# EAGLE design object counter (EAGLE 6.5.0)
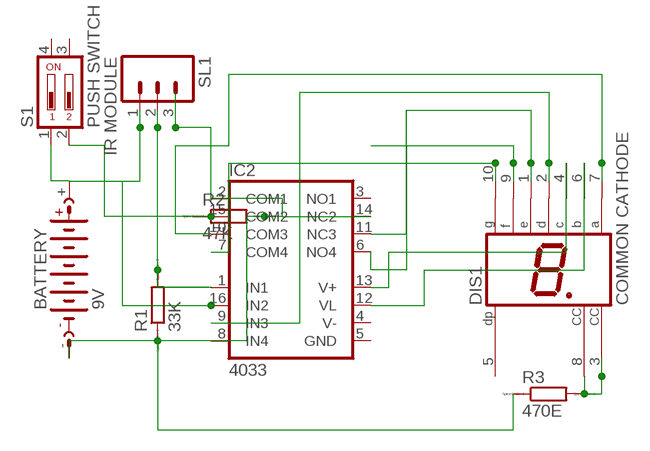
[diagram p0: schematic, sheet 1]

## Parts
BATTERY  9V  AB9V  [AB9V]
DIS1  COMMON CATHODE  HD-H103  [HDSP-M]
IC2  4033  MAX314EPE  [DIL16]
R1  33K  R0204/7  [0204/7]
R2  47K  R0204/7  [0204/7]
R3  470E  R0204/7  [0204/7]
S1  PUSH SWITCH  DS02  [DS-02]
SL1  IR MODULE  M03  [03P]

## Nets
N$1: BATTERY.- IC2.2(COM1) IC2.8(IN4) IC2.14(NC2) R1.1 R2.2 R3.1 SL1.3
N$2: BATTERY.+ IC2.16(IN2) S1.1 SL1.1
N$3: DIS1.3(CC) DIS1.8(CC) R3.2
N$4: IC2.1(IN1) R1.2 SL1.2
N$5: DIS1.7(A) IC2.10(COM3)
N$6: DIS1.6(B) IC2.12(VL)
N$7: DIS1.4(C) IC2.13(V+)
N$8: DIS1.2(D) IC2.9(IN3)
N$9: DIS1.1(E) IC2.11(NC3)
N$10: DIS1.9(F) IC2.6(NO4)
N$11: DIS1.10(G) IC2.7(COM4)
N$12: IC2.15(COM2) R2.1 S1.2
Unconnected: DIS1.5(DP) IC2.3(NO1) S1.3 S1.4

## Power pins joined to a net without a drawn wire
GND: IC2.5(GND)
V-: IC2.4(V-)

## Library data of the parts
BATTERY = battery:AB9V: 9-V BATTERY CLIP
DIS1 = display-hp:HD-H103: LED DISPLAY 1-character 7 segment, decimal point right; OC_FARNELL: unknown; OC_NEWARK: unknown
IC2 = maxim:MAX314: 10?, Quad, SPST, CMOS Analog Switches Source: http://datasheets.maxim-ic.com/en/ds/MAX312-MAX314.pdf; MPN: MAX314EPE+; OC_FARNELL: unknown; OC_NEWARK: 99K3225
R1-R3 = eagle-ltspice:R: RESISTOR, European symbol; SPICEMODEL: NONE; SPICEPREFIX: R
S1 = switch-dil:DS02: DIL/CODE SWITCH; OC_FARNELL: 9472126; OC_NEWARK: unknown
SL1 = con-amp-quick:M03: AMP QUICK CONNECTOR; OC_FARNELL: unknown; OC_NEWARK: unknown

## Board
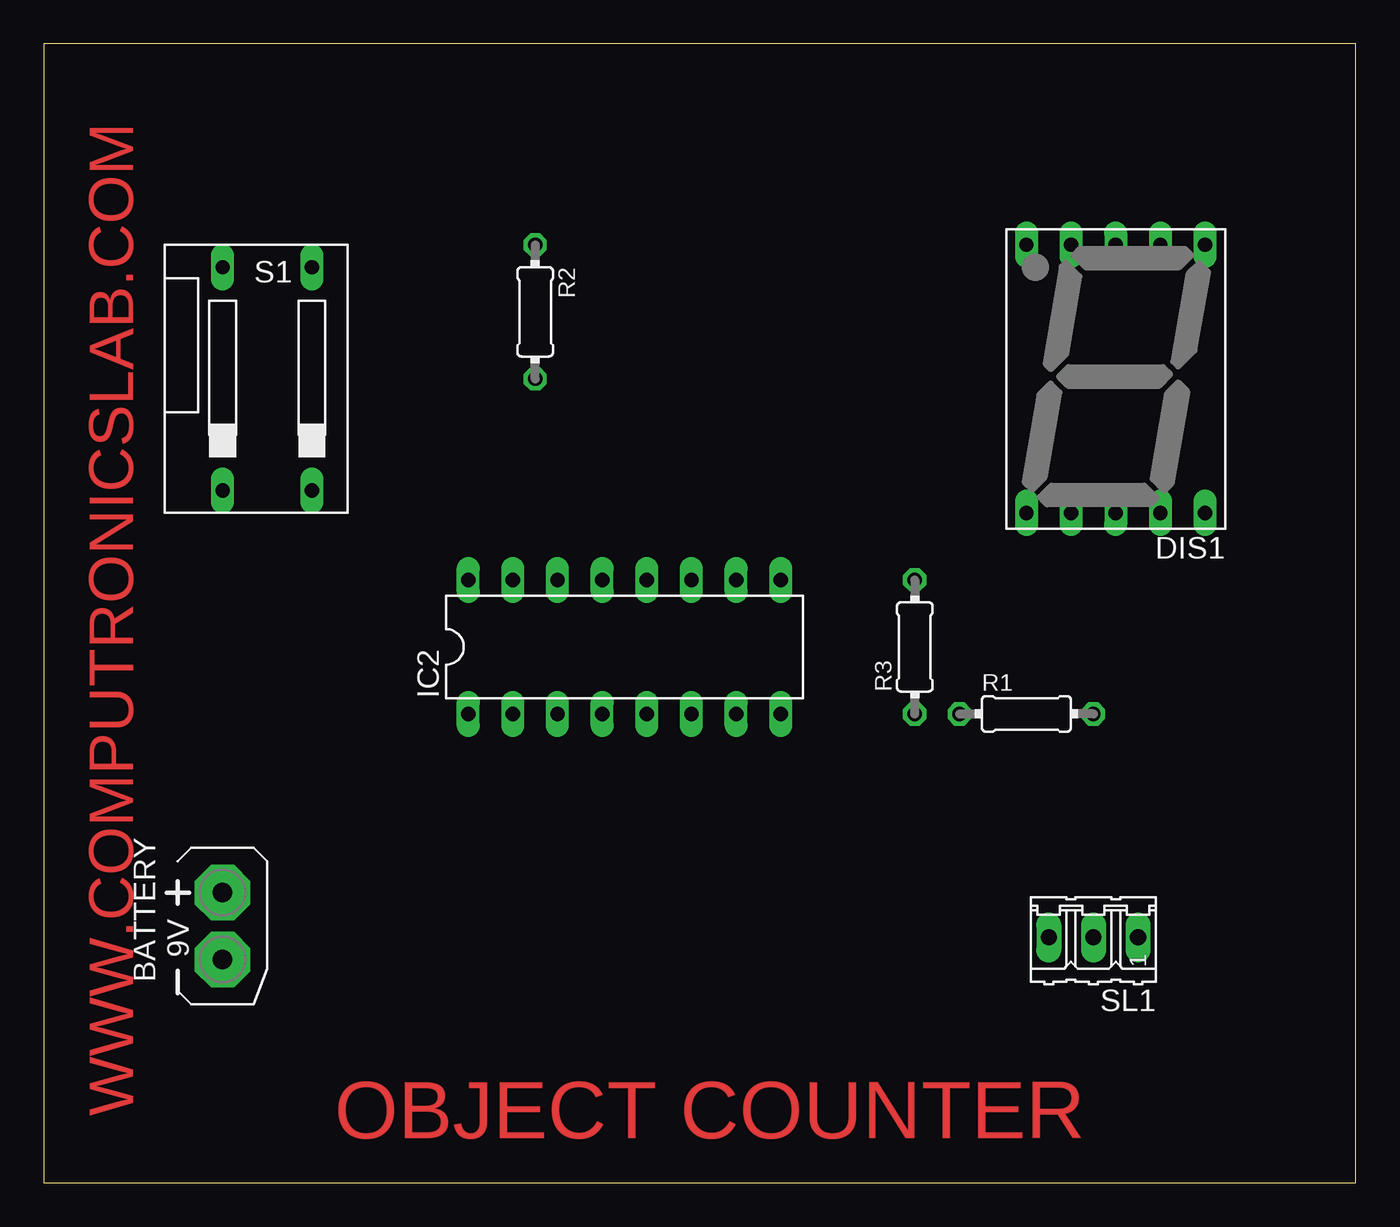
[diagram p1: board, top side]
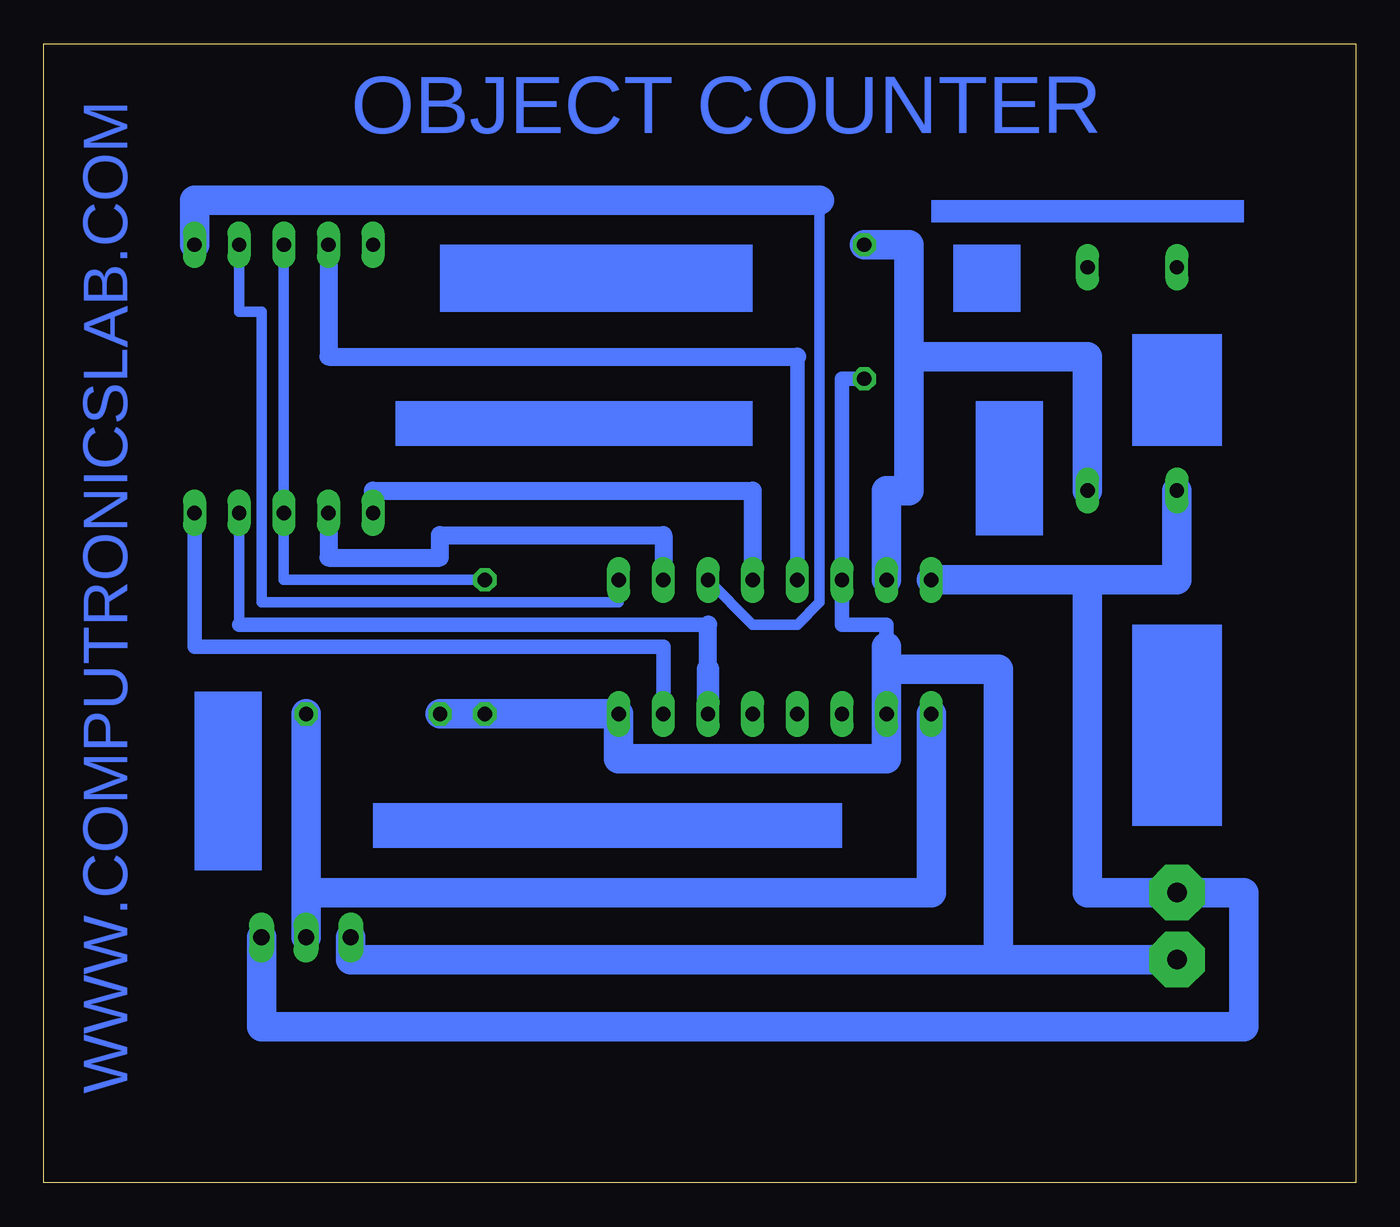
[diagram p2: board, bottom side, seen from below]

Size 74.6 x 64.76 mm. Coordinates in mm from the lower left corner, seen from the top.
Outline: 0,0 74.6,0 74.6,64.76 0,64.76 0,0
Copper layers (1*16): Top 0.035mm / dielectric 1.5mm / Bottom 0.035mm
Design rules "default": minimum track width 10mil, minimum drill 24mil, track to track 8mil, track to pad 8mil, pad to pad 8mil, via to via 8mil, smd to smd 8mil, copper to edge 40mil, drill to drill 8mil, minimum pad ring 10mil, minimum via ring 8mil, stop-mask expansion 4mil, vias tented up to drill 0mil, thermal gap 10mil

### Footprints (pad centres in the part's own frame; a part is rotated, then mirrored left to right if it is on the bottom)
AB9V = drill 1.118 pad 3.15 octagon: + 0,2.54; - 0,-1.27
HDSP-M = drill 0.813 long: 1 -5.08,-7.62; 2 -2.54,-7.62; 3 0,-7.62; 4 2.54,-7.62; 5 5.08,-7.62; 6 5.08,7.62; 7 2.54,7.62; 8 0,7.62; 9 -2.54,7.62; 10 -5.08,7.62
DIL16 = drill 0.813 long: 1 -8.89,-3.81; 2 -6.35,-3.81; 3 -3.81,-3.81; 4 -1.27,-3.81; 5 1.27,-3.81; 6 3.81,-3.81; 7 6.35,-3.81; 8 8.89,-3.81; 9 8.89,3.81; 10 6.35,3.81; 11 3.81,3.81; 12 1.27,3.81; 13 -1.27,3.81; 14 -3.81,3.81; 15 -6.35,3.81; 16 -8.89,3.81
0204/7 = drill 0.813 octagon: 1 -3.81,0; 2 3.81,0
DS-02 = drill 0.813 long: 1 -5.08,-6.35; 2 0,-6.35; 3 0,6.35; 4 -5.08,6.35
03P = drill 0.914 long: 1 -2.54,0; 2 0,0; 3 2.54,0

### Placement (x,y rotation side)
BATTERY  10.16,13.97 0 top
DIS1  60.96,45.72 180 top
IC2  33.02,30.48 0 top
R1  55.88,26.67 0 top
R2  27.94,49.53 270 top
R3  49.53,30.48 90 top
S1  15.24,45.72 0 top
SL1  59.69,13.97 180 top

### Tracks (layer width: path | path; a pad name or v marks a point on that pad's centre or on a via)
N$1
  Bottom 0.813: IC2.2 26.67,31.75 29.21,31.75 IC2.14 29.21,45.72 R2.2
  Bottom 1.676: R1.1 R3.1 IC2.8 41.91,24.13 26.67,24.13 IC2.2 26.67,29.21 | SL1.3 57.15,12.7 20.32,12.7 | BATTERY.- 20.32,12.7 | 26.67,29.21 26.67,30.48 | 26.67,29.21 20.32,29.21 20.32,12.7
N$2
  Bottom 1.676: 15.24,34.29 10.16,34.29 S1.1 | IC2.16 15.24,34.29 | SL1.1 62.23,8.89 6.35,8.89 6.35,16.51 BATTERY.+ 15.24,16.51 15.24,34.29
N$3
  Bottom 0.61: R3.2 60.96,34.29 DIS1.8 DIS1.3
N$4
  Bottom 1.676: IC2.1 24.13,16.51 59.69,16.51 | SL1.2 59.69,16.51 | 59.69,16.51 R1.2
N$5
  Bottom 1.016: IC2.10 39.37,36.83 52.07,36.83 52.07,35.56 58.42,35.56 DIS1.7
N$6
  Bottom 1.016: IC2.12 34.29,39.37 55.88,39.37 DIS1.6
N$7
  Bottom 0.813: 31.75,46.99 IC2.13
  Bottom 1.016: DIS1.4 58.42,46.99 31.75,46.99
N$8
  Bottom 0.61: IC2.9 41.91,33.02 62.23,33.02 62.23,49.53 63.5,49.53 DIS1.2
N$9
  Bottom 0.61: IC2.11 34.29,31.75 31.75,31.75 30.48,33.02 30.48,55.88
  Bottom 1.676: 30.48,55.88 66.04,55.88 DIS1.1
N$10
  Bottom 0.61: 63.5,31.75 DIS1.9
  Bottom 0.813: 36.83,31.75 63.5,31.75
  Bottom 1.016: 36.83,29.21 36.83,31.75
  Bottom 1.27: 36.83,29.21 IC2.6
N$11
  Bottom 0.813: IC2.7 39.37,30.48 66.04,30.48 DIS1.10
N$12
  Bottom 1.676: R2.1 25.4,53.34 25.4,46.99 | S1.2 15.24,46.99 25.4,46.99 | 25.4,46.99 25.4,39.37 26.67,39.37 IC2.15
(copper drawn outside any net)
  shapes: Bottom area x9

### Text on the board
Top: WWW.COMPUTRONICSLAB.COM | OBJECT COUNTER
Bottom: OBJECT COUNTER | WWW.COMPUTRONICSLAB.COM